# EAGLE design damp_v0001 - backup (EAGLE 6.4)

## Sheet 1 of 2: DAC
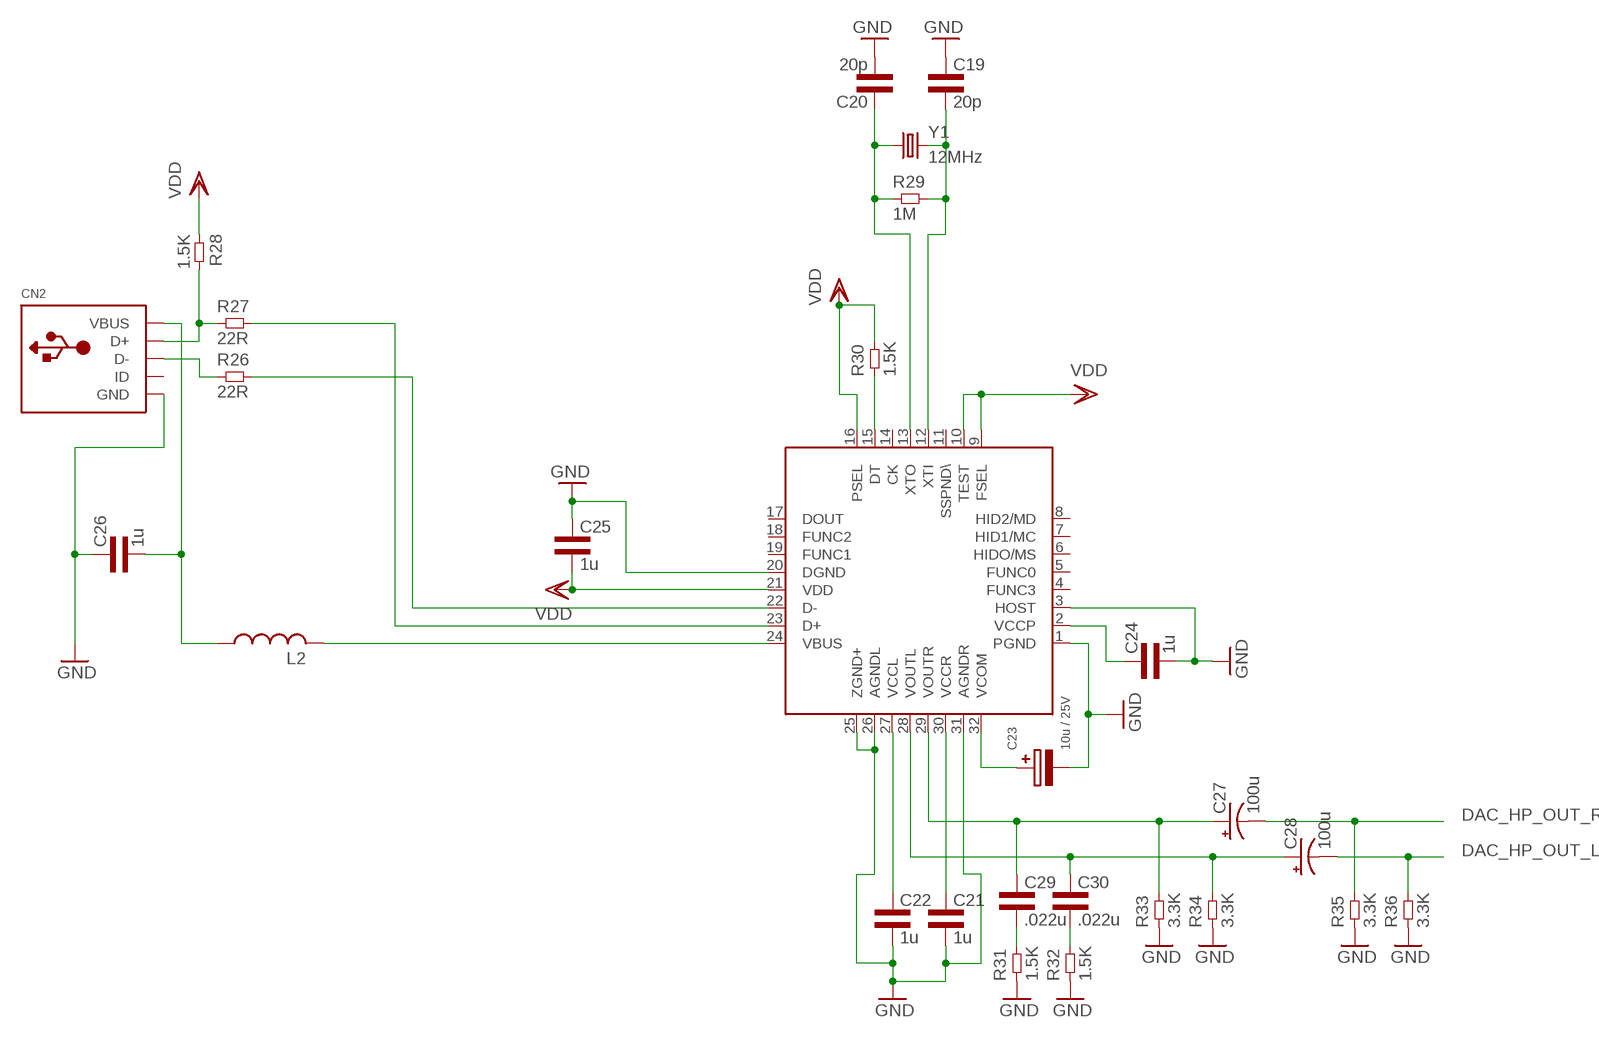
[diagram p0: schematic, sheet 1]

### Parts
C19  20p  CAP0603L3  [0603L3]
C20  20p  CAP0603L3  [0603L3]
C21  1u  CAP0603L3  [0603L3]
C22  1u  CAP0603L3  [0603L3]
C23  10u / 25V  CAP_POL  [CAP_POL_1X3]
C24  1u  CAP0603L3  [0603L3]
C25  1u  CAP0603L3  [0603L3]
C26  1u  CAP0603L3  [0603L3]
C27  100u  CPOL-USE2.5-7  [E2,5-7]
C28  100u  CPOL-USE2.5-7  [E2,5-7]
C29  .022u  CAP0603L3  [0603L3]
C30  .022u  CAP0603L3  [0603L3]
CN2  USBMINIB  [USB-MINIB]
L2  RCL_L-USL3225M  [RCL_L3225M]
R26  22R  RES0603L3  [0603L3]
R27  22R  RES0603L3  [0603L3]
R28  1.5K  RES0603L3  [0603L3]
R29  1M  RES0603L3  [0603L3]
R30  1.5K  RES0603L3  [0603L3]
R31  1.5K  RES0603L3  [0603L3]
R32  1.5K  RES0603L3  [0603L3]
R33  3.3K  RES0603L3  [0603L3]
R34  3.3K  RES0603L3  [0603L3]
R35  3.3K  RES0603L3  [0603L3]
R36  3.3K  RES0603L3  [0603L3]
U$1  PCM2707_V1_PCM2704C_PCM2707  [PCM2707_V1_PCM2704C_PCM2707]
Y1  12MHz  CRYSTALHC49US  [HC49US]

### Nets
DAC_HP_OUT_L: C28.- R36.P$2 ; also sheet 2
DAC_HP_OUT_R: C27.- R35.P$2 ; also sheet 2
GND: C19.P$1 C20.P$2 C21.P$2 C22.P$2 C23.2 C24.P$2 C25.P$1 C26.P$1 CN2.GND R31.P$1 R32.P$1 R33.P$1 R34.P$1 R35.P$1 R36.P$1 U$1.1(PGND) U$1.3(HOST) U$1.20(DGND) U$1.25(ZGND+) U$1.26(AGNDL) U$1.31(AGNDR) ; also sheet 2
N$18: CN2.D+ R27.P$1 R28.P$2
N$21: CN2.D- R26.P$1
N$37: R27.P$2 U$1.23(D+)
N$42: R26.P$2 U$1.22(D-)
N$43: C20.P$1 R29.P$1 U$1.13(XTO) Y1.1
N$44: C19.P$2 R29.P$2 U$1.12(XTI) Y1.2
N$45: C22.P$1 U$1.27(VCCL)
N$50: C21.P$1 U$1.30(VCCR)
N$51: C23.1 U$1.32(VCOM)
N$52: C29.P$2 R31.P$2
N$53: C24.P$1 U$1.2(VCCP)
N$54: C27.+ C29.P$1 R33.P$2 U$1.29(VOUTR)
N$55: L2.2 U$1.24(VBUS)
N$56: C26.P$2 CN2.VBUS L2.1
N$57: C28.+ C30.P$1 R34.P$2 U$1.28(VOUTL)
N$58: R30.P$1 U$1.15(DT)
N$59: C30.P$2 R32.P$2
VDD: C25.P$2 R28.P$1 R30.P$2 U$1.9(FSEL) U$1.10(TEST) U$1.16(PSEL) U$1.21(VDD)
Unconnected: CN2.ID U$1.4(FUNC3) U$1.5(FUNC0) U$1.6(HIDO/MS) U$1.7(HID1/MC) U$1.8(HID2/MD) U$1.11(SSPND\) U$1.14(CK) U$1.17(DOUT) U$1.18(FUNC2) U$1.19(FUNC1)

## Sheet 2 of 2: Amp
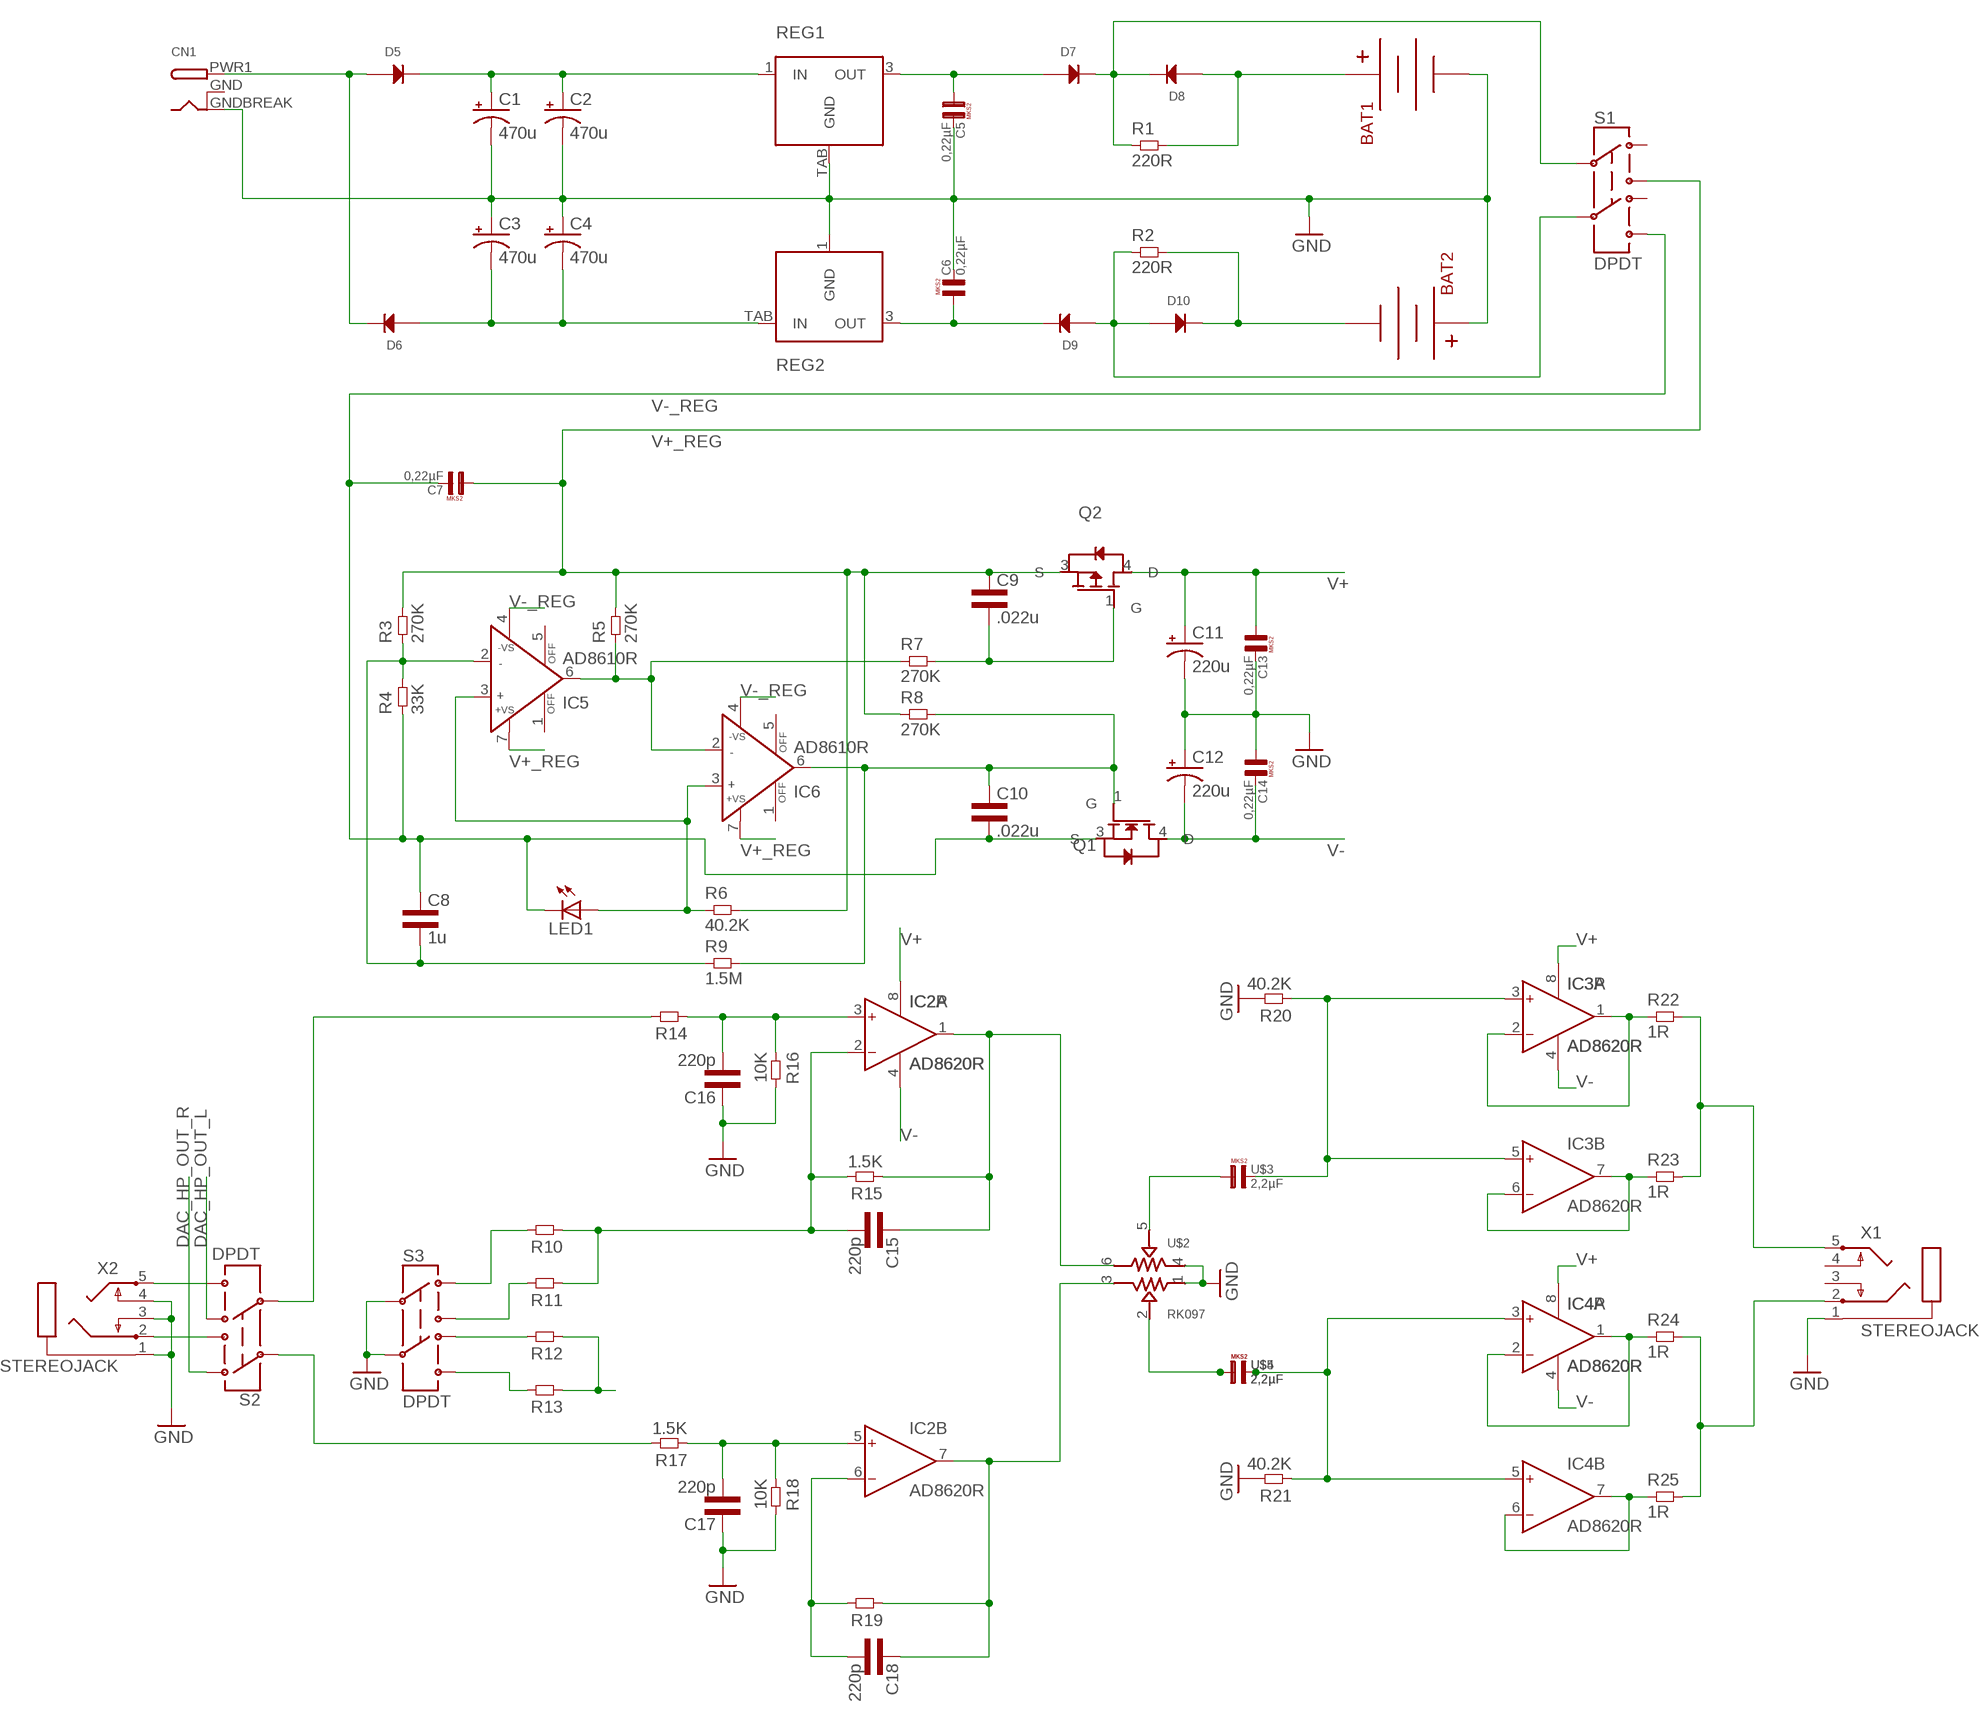
[diagram p1: schematic, sheet 2]

### Parts
BAT1  BC9VPC  [BC9VPC]
BAT2  BC9VPC  [BC9VPC]
C1  470u  CPOL-USE5-13  [E5-13]
C2  470u  CPOL-USE5-13  [E5-13]
C3  470u  CPOL-USE5-13  [E5-13]
C4  470u  CPOL-USE5-13  [E5-13]
C5  0,22µF  [R5B3]
C6  0,22µF  [R5B3]
C7  0,22µF  [R5B3]
C8  1u  CAP0603L3  [0603L3]
C9  .022u  CAP0603L3  [0603L3]
C10  .022u  CAP0603L3  [0603L3]
C11  220u  CPOL-USE5-10.5  [E5-10,5]
C12  220u  CPOL-USE5-10.5  [E5-10,5]
C13  0,22µF  [R5B3]
C14  0,22µF  [R5B3]
C15  220p  CAP0603L3  [0603L3]
C16  220p  CAP0603L3  [0603L3]
C17  220p  CAP0603L3  [0603L3]
C18  220p  CAP0603L3  [0603L3]
CN1  DCBARRELSMT  [DCJACK_2MM_SMT]
D5  DIODEDO-214AC  [DO-214AC]
D6  DIODEDO-214AC  [DO-214AC]
D7  DIODEDO-214AC  [DO-214AC]
D8  DIODEDO-214AC  [DO-214AC]
D9  DIODEDO-214AC  [DO-214AC]
D10  DIODEDO-214AC  [DO-214AC]
IC2  AD8620R  [SO8]
IC3  AD8620R  [SO8]
IC4  AD8620R  [SO8]
IC5  AD8610R  [SO8]
IC6  AD8610R  [SO8]
LED1  LEDCHIPLED_0805  [CHIPLED_0805]
Q1  MOSFET-N  [DPAK-3]
Q2  MOSFET-P  [DPAK-3]
R1  220R  RES0603L3  [0603L3]
R2  220R  RES0603L3  [0603L3]
R3  270K  RES0603L3  [0603L3]
R4  33K  RES0603L3  [0603L3]
R5  270K  RES0603L3  [0603L3]
R6  40.2K  RES0603L3  [0603L3]
R7  270K  RES0603L3  [0603L3]
R8  270K  RES0603L3  [0603L3]
R9  1.5M  RES0603L3  [0603L3]
R10  RES0603L3  [0603L3]
R11  RES0603L3  [0603L3]
R12  RES0603L3  [0603L3]
R13  RES0603L3  [0603L3]
R14  RES0603L3  [0603L3]
R15  1.5K  RES0603L3  [0603L3]
R16  10K  RES0603L3  [0603L3]
R17  1.5K  RES0603L3  [0603L3]
R18  10K  RES0603L3  [0603L3]
R19  RES0603L3  [0603L3]
R20  40.2K  RES0603L3  [0603L3]
R21  40.2K  RES0603L3  [0603L3]
R22  1R  RES1206L3  [1206L3]
R23  1R  RES1206L3  [1206L3]
R24  1R  RES1206L3  [1206L3]
R25  1R  RES1206L3  [1206L3]
REG1  MC7812  [D2PAK]
REG2  MC7912  [D2PAK]
S1  DPDT  SPARKFUN-ELECTROMECHANICAL_SWITCH-DPDTAYZ0202  [SPARKFUN-ELECTROMECHANICAL_AYZ0202]
S2  DPDT  SPARKFUN-ELECTROMECHANICAL_SWITCH-DPDTAYZ0202  [SPARKFUN-ELECTROMECHANICAL_AYZ0202]
S3  DPDT  SPARKFUN-ELECTROMECHANICAL_SWITCH-DPDTAYZ0202  [SPARKFUN-ELECTROMECHANICAL_AYZ0202]
U$2  RK097  [RK097]
U$3  2,2µF  [R5B7K2]
U$4  2,2µF  [R5B7K2]
U$5  2,2µF  [R5B7K2]
X1  STEREOJACK  [STX3100]
X2  STEREOJACK  [STX3100]

### Nets
DAC_HP_OUT_L: S2.4 ; also sheet 1
DAC_HP_OUT_R: S2.1 ; also sheet 1
GND: BAT1.V- BAT2.V+ C1.- C2.- C3.+ C4.+ C5.2 C6.2 C11.- C12.+ C13.2 C14.1 C16.P$1 C17.P$1 CN1.GNDBREAK(GND) R16.P$2 R18.P$2 R20.P$2 R21.P$2 REG1.TAB(GND) REG2.1(GND) S3.2 S3.5 U$2.1 U$2.4 X1.1 X2.1 X2.3 X2.4 ; also sheet 1
N$2: C1.+ C2.+ D5.2(CATHODE) REG1.1(IN)
N$3: C3.- C4.- D6.1(ANODE) REG2.TAB(IN)
N$4: C5.1 D7.1(ANODE) REG1.3(OUT)
N$5: C6.1 D9.2(CATHODE) REG2.3(OUT)
N$6: C8.P$2 IC5.2(IN-) R3.P$1 R4.P$2 R9.P$1
N$7: D7.2(CATHODE) D8.2(CATHODE) R1.P$1 S1.2
N$8: BAT1.V+ D8.1(ANODE) R1.P$2
N$9: D9.1(ANODE) D10.1(ANODE) R2.P$1 S1.5
N$10: BAT2.V- D10.2(CATHODE) R2.P$2
N$11: CN1.PWR1(PWR) D5.1(ANODE) D6.2(CATHODE)
N$13: IC5.6(OUT) IC6.2(IN-) R5.P$1 R7.P$1
N$14: IC5.3(IN+) IC6.3(IN+) LED1.A R6.P$1
N$16: S2.6 X2.5
N$17: S2.3 X2.2
N$19: C10.P$1 IC6.6(OUT) Q1.1(G) R8.P$2 R9.P$2
N$20: C9.P$2 Q2.1(G) R7.P$2
N$22: R14.P$2 S2.5
N$23: R17.P$2 S2.2
N$24: C17.P$2 IC2.5(B:IN+) R17.P$1 R18.P$1
N$25: R10.P$2 S3.1
N$26: R11.P$2 S3.3
N$27: R12.P$2 S3.4
N$28: R13.P$2 S3.6
N$29: C15.P$2 IC2.2(A:IN-) R10.P$1 R11.P$1 R15.P$2
N$30: R12.P$1 R13.P$1
N$31: C16.P$2 IC2.3(A:IN+) R14.P$1 R16.P$1
N$32: C15.P$1 IC2.1(A:OUT) R15.P$1 U$2.6
N$33: R22.2 R23.2 X1.5
N$34: C18.P$2 IC2.6(B:IN-) R19.P$2
N$35: C18.P$1 IC2.7(B:OUT) R19.P$1 U$2.3
N$36: R24.2 R25.2 X1.2
N$38: U$2.2 U$4.1 U$5.1
N$39: IC4.3(A:IN+) IC4.5(B:IN+) R21.P$1 U$4.2 U$5.2
N$40: U$2.5 U$3.1
N$41: IC3.3(A:IN+) IC3.5(B:IN+) R20.P$1 U$3.2
N$46: IC3.1(A:OUT) IC3.2(A:IN-) R22.1
N$47: IC3.6(B:IN-) IC3.7(B:OUT) R23.1
N$48: IC4.1(A:OUT) IC4.2(A:IN-) R24.1
N$49: IC4.6(B:IN-) IC4.7(B:OUT) R25.1
V+: C11.+ C13.1 IC2.8(P:V+) IC3.8(P:V+) IC4.8(P:V+) Q2.4(D)
V+_REG: C7.1 C9.P$1 IC5.7(+VS) IC6.7(+VS) Q2.3(S) R3.P$2 R5.P$2 R6.P$2 R8.P$1 S1.3
V-: C12.- C14.2 IC2.4(P:V-) IC3.4(P:V-) IC4.4(P:V-) Q1.4(D)
V-_REG: C7.2 C8.P$1 C10.P$2 IC5.4(-VS) IC6.4(-VS) LED1.C Q1.3(S) R4.P$1 S1.6
Unconnected: IC5.1(OFF) IC5.5(OFF) IC6.1(OFF) IC6.5(OFF) S1.1 S1.4 X1.3 X1.4

## Power pins joined to a net without a drawn wire
GNDBREAK: CN1.GND(GNDBREAK)

## Library data of the parts
BAT1 BAT2 = SparkFun-Connectors:BC9VPC: 9V board-mount battery cradle
C1-C4 C11 C12 C27 C28 = rcl:CPOL-US: POLARIZED CAPACITOR, American symbol
C5-C7 C13 C14 = Capacitor-Wima-MKS2-63v:0,22µF
C8-C10 C15-C22 C24-C26 C29 C30 = common:CAP
C23 = common:CAP_POL
CN1 = adafruit:DCBARREL: 2.0mm DC Barrel Jack DCJACK_2MM_PTH - Through Hole Jack (4UConnector: 05537)
CN2 = adafruit:USB: USB Connectors USBMINIB - Surface Mount Female Mini-B USB Connector 4UConnector: 06564 By microbuilder.eu Thru-hole RA Female Mini-B USB Connector 4UConnector: 18732 By ladyada.net
D5-D10 = common:DIODE
IC2-IC4 = analog-devices:AD8620: Precision, Very Low Noise, Low Input Bias Current, Wide Bandwidth JFET Operational Amplifiers Source: http://www.analog.com/static/imported-files/data_sheets/AD8610_8620.pdf; MF: ALTERA CORPORATION; MPN: AD8620ARZ; OC_FARNELL: 9994386; OC_NEWARK: 59K6972
IC5 IC6 = analog-devices:AD8610: Precision, Very Low Noise, Low Input Bias Current, Wide Bandwidth JFET Operational Amplifiers Source: http://www.analog.com/static/imported-files/data_sheets/AD8610_8620.pdf; MF: ALTERA CORPORATION; MPN: AD8610BRZ; OC_FARNELL: 8621578; OC_NEWARK: 59K6944
L2 = pcm2707_v1:RCL_L-US: INDUCTOR, American symbol
LED1 = adafruit:LED: LED OSRAM: - CHIPLED LG R971, LG N971, LY N971, LG Q971, LY Q971, LO R971, LY R971 LH N974, LH R974 LS Q976, LO Q976, LY Q976 LO Q996 - Hyper CHIPLED LW Q18S LB Q993, LB Q99A, LB R99A - SideLED LS A670, LO A670, LY A670, LG A670, LP A670 LB A673, LV A673, LT A673, LW A673 LH A674 LY A675 LS A676, LA A676, LO A676, LY A676, LW A676 LS A679, LY A679, LG A679 - Hyper Micro SIDELED® LS Y876, LA Y876, LO Y876, LY Y876 LT Y87S - SmartLED LW L88C, LW L88S LB L89C, LB L89S, LG L890 LS L89K, LO L89K, LY L89K LS L896, LA L896, LO L896, LY L896 - TOPLED LS T670, LO T670, LY T670, LG T670, LP T670 LSG T670, LSP T670, LSY T670, LOP T670, LYG T670 LG T671, LOG T671, LSG T671 LB T673, LV T673, LT T673, LW T673 LH T674 LS T676, LA T676, LO T676, LY T676, LB T676, LH T676, LSB T676, LW T676 LB T67C, LV T67C, LT T67C, LS T67K, LO T67K, LY T67K, LW E67C LS E67B, LA E67B, LO E67B, LY E67B, LB E67C, LV E67C, LT E67C LW T67C LS T679, LY T679, LG T679 LS T770, LO T770, LY T770, LG T770, LP T770 LB T773, LV T773, LT T773, LW T773 LH T774 LS E675, LA E675, LY E675, LS T675 LS T776, LA T776, LO T776, LY T776, LB T776 LHGB T686 LT T68C, LB T68C - Hyper Mini TOPLED® LB M676 - Mini TOPLED Santana® LG M470 LS M47K, LO M47K, LY M47K Source: http://www.osram.convergy.de/
Q1 = common:MOSFET-N
Q2 = common:MOSFET-P
R1-R36 = common:RES
REG1 = common:MC7812
REG2 = common:MC7912
S1-S3 = my_dac_amp:SPARKFUN-ELECTROMECHANICAL_SWITCH-DPDT: DPDT Version of the COM-00597; PROD_ID: SWCH-08179
U$1 = my_dac_amp:PCM2707_V1_PCM2704C_PCM2707: Upgraded version of the PCM2704. It allows connecting to a device with USB and transmitting that data to another DAC using I2S protocol. Also has other advanced features that allow control with SPI, external buttons, etc.
U$2 = SparkFun-Electromechanical:RK097
U$3-U$5 = Capacitor-Wima-MKS2-63v:2,2µF
X1 X2 = adafruit:STEREOJACK: MIC/HEADPHONE JACK Stereo jack with two switches. Kycon STX3100, CUI SJ1-3555NG and/or 4UCon 05544
Y1 = SparkFun-FreqCtrl:CRYSTAL: Various standard crystals. Proven footprints. Spark Fun Electronics SKU : COM-00534

## Board
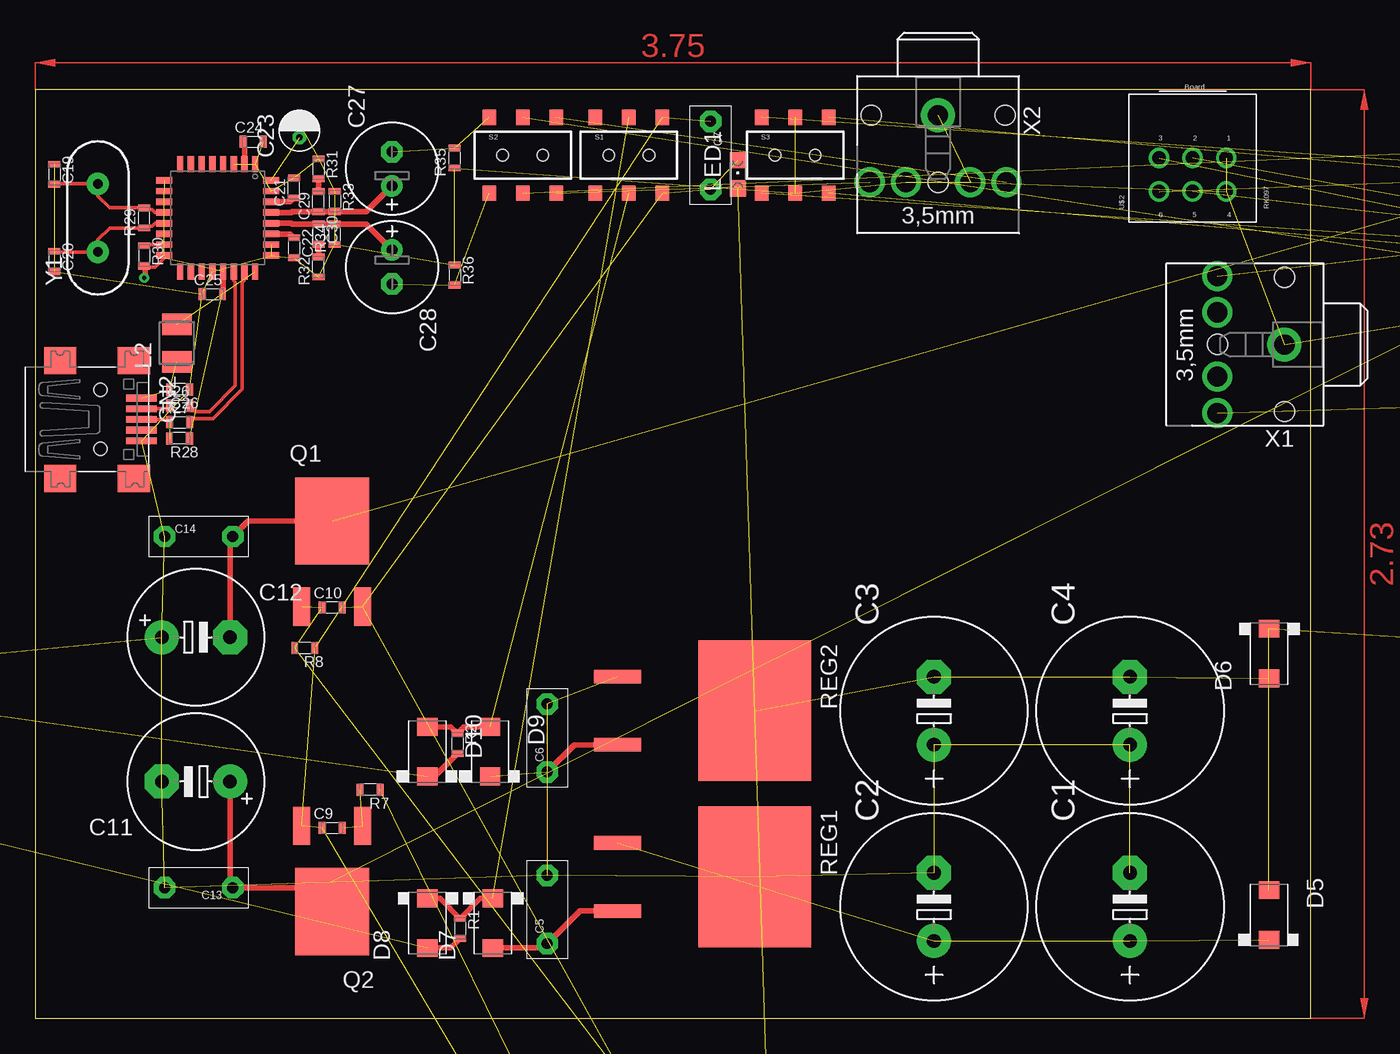
[diagram p2: board, top side]

Size 95.18 x 69.32 mm. Coordinates in mm from the lower left corner, seen from the top.
Outline: 0,0 95.18,0 95.18,69.32 0,69.32 0,0
Copper layers (1*16): Top 0.035mm / dielectric 1.5mm / Bottom 0.035mm
Design rules "default": minimum track width 10mil, minimum drill 24mil, track to track 8mil, track to pad 8mil, pad to pad 8mil, via to via 8mil, smd to smd 8mil, copper to edge 40mil, drill to drill 8mil, minimum pad ring 10mil, minimum via ring 8mil, stop-mask expansion 4mil, vias tented up to drill 0mil, thermal gap 10mil

### Footprints (pad centres in the part's own frame; a part is rotated, then mirrored left to right if it is on the bottom)
BC9VPC = drill 2.032 square: V+ 53.086,21.336; V- 53.086,8.382 | hole 2.286: 27.178,3.81; 13.716,26.162; 40.64,26.162
E5-13 = drill 1.016 pad 2.54: + -2.54,0 | drill 1.016 pad 2.54 octagon: - 2.54,0
R5B3 = drill 0.813 pad 1.6 octagon: 1 -2.54,0; 2 2.54,0
0603L3 = smd 0.5 x 0.9: P$1 -0.75,0; P$2 0.75,0
E5-10,5 = drill 1.016 pad 2.54: + -2.54,0 | drill 1.016 pad 2.54 octagon: - 2.54,0
CAP_POL_1X3 = drill 0.5 pad 0.813 octagon: 1 -0.5,0 | drill 0.5 pad 0.813: 2 0.5,0
E2,5-7 = drill 0.813 pad 1.6: + -1.27,0 | drill 0.813 pad 1.6 octagon: - 1.27,0
DCJACK_2MM_SMT = smd 2.4 x 2: GND 0,-5.5; GNDBREAK 6.2,-5.5; PWR1 0,5.5; PWR2 6.2,5.5 | hole 1.6: 0,0 | hole 1.8: 4.5,0
USB-MINIB = smd 0.5 x 2.308: D+ 0,4.064; D- -0.8,4.064; GND 1.6,4.064; ID 0.8,4.064; VBUS -1.6,4.064 | smd 2 x 2.4: GND1 -4.4,-2; GND2 -4.4,3.5; GND3 4.4,3.5; GND4 4.4,-2 | hole 1: -2.2,1; 2.2,1
DO-214AC = smd 1.32 x 1.52: 1 -1.85,0; 2 1.85,0
SO8 = smd 0.6 x 2.2: 1 -1.905,-2.6; 2 -0.635,-2.6; 3 0.635,-2.6; 4 1.905,-2.6; 5 1.905,2.6; 6 0.635,2.6; 7 -0.635,2.6; 8 -1.905,2.6
RCL_L3225M = smd 1.6 x 2.2: 1 -1.4,0; 2 1.4,0
CHIPLED_0805 = smd 1.2 x 1.2: A 0,-1.05; C 0,1.05
DPAK-3 = smd 1.25 x 2.85: 1 -2.28,-3.2; 3 2.28,-3.2 | smd 5.55 x 6.5: 4 0,3.2
1206L3 = smd 0.9 x 1.7: 1 -1.45,0; 2 1.45,0
D2PAK = smd 1.016 x 3.504: 1 -2.54,-5.106; 3 2.54,-5.106 | smd 10.49 x 8.38: TAB 0,5.106
SPARKFUN-ELECTROMECHANICAL_AYZ0202 = smd 1 x 1.15: 1 -2.5,2.825; 2 0,2.825; 3 2.5,2.825; 4 -2.5,-2.825; 5 0,-2.825; 6 2.5,-2.825 | hole 0.85: 1.5,0; -1.5,0
PCM2707_V1_PCM2704C_PCM2707 = smd 0.47 x 1.2: 1 -2.8,-4; 2 -2,-4; 3 -1.2,-4; 4 -0.4,-4; 5 0.4,-4; 6 1.2,-4; 7 2,-4; 8 2.8,-4; 17 2.8,4; 18 2,4; 19 1.2,4; 20 0.4,4; 21 -0.4,4; 22 -1.2,4; 23 -2,4; 24 -2.8,4 | smd 1.2 x 0.47: 9 4,-2.8; 10 4,-2; 11 4,-1.2; 12 4,-0.4; 13 4,0.4; 14 4,1.2; 15 4,2; 16 4,2.8; 25 -4,2.8; 26 -4,2; 27 -4,1.2; 28 -4,0.4; 29 -4,-0.4; 30 -4,-1.2; 31 -4,-2; 32 -4,-2.8
RK097 = drill 1: 1 2.5,0; 2 0,0; 3 -2.5,0; 4 2.5,-2.5; 5 0,-2.5; 6 -2.5,-2.5
R5B7K2 = drill 0.813 pad 1.6 octagon: 1 -2.54,0; 2 2.54,0
STX3100 = drill 1.5 pad 2.54: 1 2.7,-0.1 | drill 1.5: 2 7.7,5; 3 7.7,2.3; 4 7.7,-2.5; 5 7.7,-5.2 | hole 1.5: 2.7,4.9; 2.7,-5.1; 7.7,-0.1
HC49US = drill 0.7 pad 1.651: 1 -2.54,0; 2 2.54,0

### Placement (x,y rotation side)
BAT1  -29.67,-28.24 90 top  (outside the outline)
BAT2  -8.74,-28.45 90 top  (outside the outline)
C1  81.69,8.33 90 top
C2  67.06,8.33 90 top
C3  67.06,22.96 90 top
C4  81.69,22.96 90 top
C5  38.2,8.13 90 top
C6  38.2,20.93 90 top
C7  50.39,64.41 270 top
C8  58.12,-24.38 90 top  (outside the outline)
C9  22.15,14.22 0 top
C10  22.15,30.68 0 top
C11  11.99,17.68 180 top
C12  11.99,28.45 0 top
C13  12.19,9.75 180 top
C14  12.19,35.97 0 top
C15  116.13,66.24 180 top  (outside the outline)
C16  113.39,66.24 0 top  (outside the outline)
C17  112.17,54.46 0 top  (outside the outline)
C18  114.81,54.46 180 top  (outside the outline)
C19  1.42,62.99 270 top
C20  1.42,56.49 270 top
C21  19.3,61.98 90 top
C22  19.3,57.51 270 top
C23  19.71,66.24 90 top
C24  16.26,65.43 0 top
C25  13.21,54.05 0 top
C26  10.77,46.94 180 top
C27  26.62,63.4 90 top
C28  26.62,56.08 270 top
C29  21.13,60.96 90 top
C30  21.13,58.52 270 top
CN1  206.25,21.54 270 top  (outside the outline)
CN2  3.86,44.7 270 top
D5  92.05,7.72 270 top
D6  92.05,27.23 90 top
D7  34.14,7.11 90 top
D8  29.26,7.11 90 top
D9  33.93,19.91 270 top
D10  29.26,19.91 270 top
IC2  114.81,60.35 180 top  (outside the outline)
IC3  135.13,66.65 180 top  (outside the outline)
IC4  135.13,52.63 180 top  (outside the outline)
IC5  46.53,-32.11 0 top  (outside the outline)
IC6  54.66,-24.59 0 top  (outside the outline)
L2  10.57,50.39 90 top
LED1  52.43,62.99 0 top
Q1  22.15,33.93 0 top
Q2  22.15,11.18 180 top
R1  31.7,6.71 270 top
R2  31.5,20.52 270 top
R3  45.11,-36.98 180 top  (outside the outline)
R4  47.75,-36.98 180 top  (outside the outline)
R5  46.74,-27.23 180 top  (outside the outline)
R6  56.08,-29.46 0 top  (outside the outline)
R7  24.99,17.07 180 top
R8  20.12,27.64 180 top
R9  56.08,-19.51 180 top  (outside the outline)
R10  215.8,56.29 0 top  (outside the outline)
R11  215.8,53.44 0 top  (outside the outline)
R12  215.8,50.6 0 top  (outside the outline)
R13  215.8,47.75 0 top  (outside the outline)
R14  113.39,65.02 180 top  (outside the outline)
R15  116.13,65.02 180 top  (outside the outline)
R16  113.39,67.46 180 top  (outside the outline)
R17  112.17,55.68 180 top  (outside the outline)
R18  112.17,53.24 180 top  (outside the outline)
R19  114.81,55.68 180 top  (outside the outline)
R20  231.44,24.79 0 top  (outside the outline)
R21  231.44,21.95 0 top  (outside the outline)
R22  140,69.49 0 top  (outside the outline)
R23  137.36,61.16 0 top  (outside the outline)
R24  140.21,55.47 0 top  (outside the outline)
R25  137.57,46.74 0 top  (outside the outline)
R26  10.77,45.72 0 top
R27  10.77,44.5 0 top
R28  10.77,43.28 180 top
R29  8.13,59.74 90 top
R30  8.13,56.9 270 top
R31  21.13,63.4 270 top
R32  21.13,56.08 90 top
R33  22.35,60.96 270 top
R34  22.35,58.52 90 top
R35  31.29,64.21 90 top
R36  31.29,55.47 270 top
REG1  48.56,10.57 270 top
REG2  48.56,22.96 270 top
S1  44.3,64.41 0 top
S2  36.37,64.41 0 top
S3  56.69,64.41 0 top
U$1  13.61,59.74 180 top
U$2  86.36,64.21 0 top
U$3  233.27,45.31 0 top  (outside the outline)
U$4  233.27,37.8 0 top  (outside the outline)
U$5  233.27,30.28 0 top  (outside the outline)
X1  95.91,50.19 180 top
X2  67.46,70.1 270 top
Y1  4.67,59.74 90 top

### Tracks (layer width: path | path; a pad name or v marks a point on that pad's centre or on a via)
DAC_HP_OUT_L  (2 unrouted)
DAC_HP_OUT_R  (2 unrouted)
GND  (49 unrouted)
N$2  (3 unrouted)
N$3  (3 unrouted)
N$4
  Top 0.406: REG1.3 40.64,8.03 C5.1 37.88,5.26 D7.1
N$5  (1 unrouted)
  Top 0.406: REG2.3 40.23,20.42 C6.1
N$6  (4 unrouted)
N$7  (1 unrouted)
  Top 0.406: D7.2 33.21,8.96 R1.P$1 30.19,8.96 D8.2
N$8  (1 unrouted)
  Top 0.406: D8.1 31.01,5.26 R1.P$2
N$9  (1 unrouted)
  Top 0.406: D10.1 31.01,21.76 R2.P$1 31.99,21.76 D9.1
N$10  (1 unrouted)
  Top 0.406: D10.2 29.79,18.06 R2.P$2
N$11  (2 unrouted)
N$13  (3 unrouted)
N$14  (3 unrouted)
N$16  (1 unrouted)
N$17  (1 unrouted)
N$18  (1 unrouted)
  Top 0.254: CN2.D+ 9.82,44.7 R27.P$1
N$19  (4 unrouted)
N$20  (2 unrouted)
N$21
  Top 0.254: CN2.D- 9.8,45.5 R26.P$1
N$22  (1 unrouted)
N$23  (1 unrouted)
N$24  (3 unrouted)
N$25  (1 unrouted)
N$26  (1 unrouted)
N$27  (1 unrouted)
N$28  (1 unrouted)
N$29  (4 unrouted)
N$30  (1 unrouted)
N$31  (3 unrouted)
N$32  (3 unrouted)
N$33  (2 unrouted)
N$34  (2 unrouted)
N$35  (3 unrouted)
N$36  (2 unrouted)
N$37
  Top 0.254: U$1.23 15.57,55.7 15.57,55.07 15.44,54.94 15.44,46.96 13.26,44.78 11.8,44.78 R27.P$2
N$38  (2 unrouted)
N$39  (4 unrouted)
N$40  (1 unrouted)
N$41  (3 unrouted)
N$42
  Top 0.254: U$1.22 14.81,55.07 14.94,54.94 14.94,47.22 13.01,45.29 11.95,45.29 R26.P$2
N$43
  Top 0.254: U$1.13 8.95,59.34 8.74,59.13 8.27,59.13 R29.P$1 5.55,58.99 4.67,58.11 Y1.1 1.46,57.2 C20.P$1
N$44
  Top 0.254: U$1.12 8.95,60.14 8.74,60.35 8.27,60.35 R29.P$2 5.55,60.49 4.67,61.37 Y1.2 1.46,62.28 C19.P$2
N$45
  Top 0.406: U$1.27 19.02,58.54 C22.P$1
N$46  (2 unrouted)
N$47  (2 unrouted)
N$48  (2 unrouted)
N$49  (2 unrouted)
N$50
  Top 0.406: U$1.30 19.02,60.94 C21.P$1
N$51  (1 unrouted)
N$52
  Top 0.406: C29.P$2 R31.P$2
N$53
  Top 0.406: U$1.2 15.61,65.32 C24.P$1
N$54
  Top 0.406: U$1.29 19.1,60.15 19.16,60.21 C29.P$1 R33.P$2 24.7,60.21 C27.+
N$55  (1 unrouted)
N$56  (2 unrouted)
N$57
  Top 0.406: U$1.28 19.1,59.33 19.16,59.27 C30.P$1 R34.P$2 24.7,59.27 C28.+
N$58
  Top 0.254: U$1.15 8.22,57.74 R30.P$1
N$59
  Top 0.406: C30.P$2 R32.P$2
V+  (3 unrouted)
  Top 0.406: C11.+ 14.53,9.96 C13.1 21.54,9.75 21.95,10.16 21.95,8.18 Q2.4
V+_REG  (9 unrouted)
V-  (3 unrouted)
  Top 0.406: C12.- 14.53,35.76 C14.2 15.9,37.13 Q1.4
V-_REG  (8 unrouted)
VDD  (via drill 0.33)  (4 unrouted)
  Top 0.254: U$1.16 9.61,56.76 8.94,56.08 8.19,56.08 R30.P$2
  Top 0.406: 8.19,56.08 8.19,55.33 v8.13,55.27 | U$1.21 14.01,54.11 C25.P$2
(copper drawn outside any net)
  shapes: Top area x2